# EasyEDA Pro project ProPrj_外设电路PCB板制作_2025-12-27.epro

# Schematic Schematic2
Board Name: 过压保护电路; Create Date: 2025-12-12; Page Name: P1; Project Name: 外设电路PCB板制作; Schematic Name: Schematic2; Update Date: 2025-12-12; BladeWidth: 10; Company: 嘉立创EDA; Page Size: A4; RegionStart: 1; ShowBorder: 1; TitleBlock: 1; TitleBlockPosition: 3; Version: V1.0; XRegionCount: 6; YRegionCount: 4
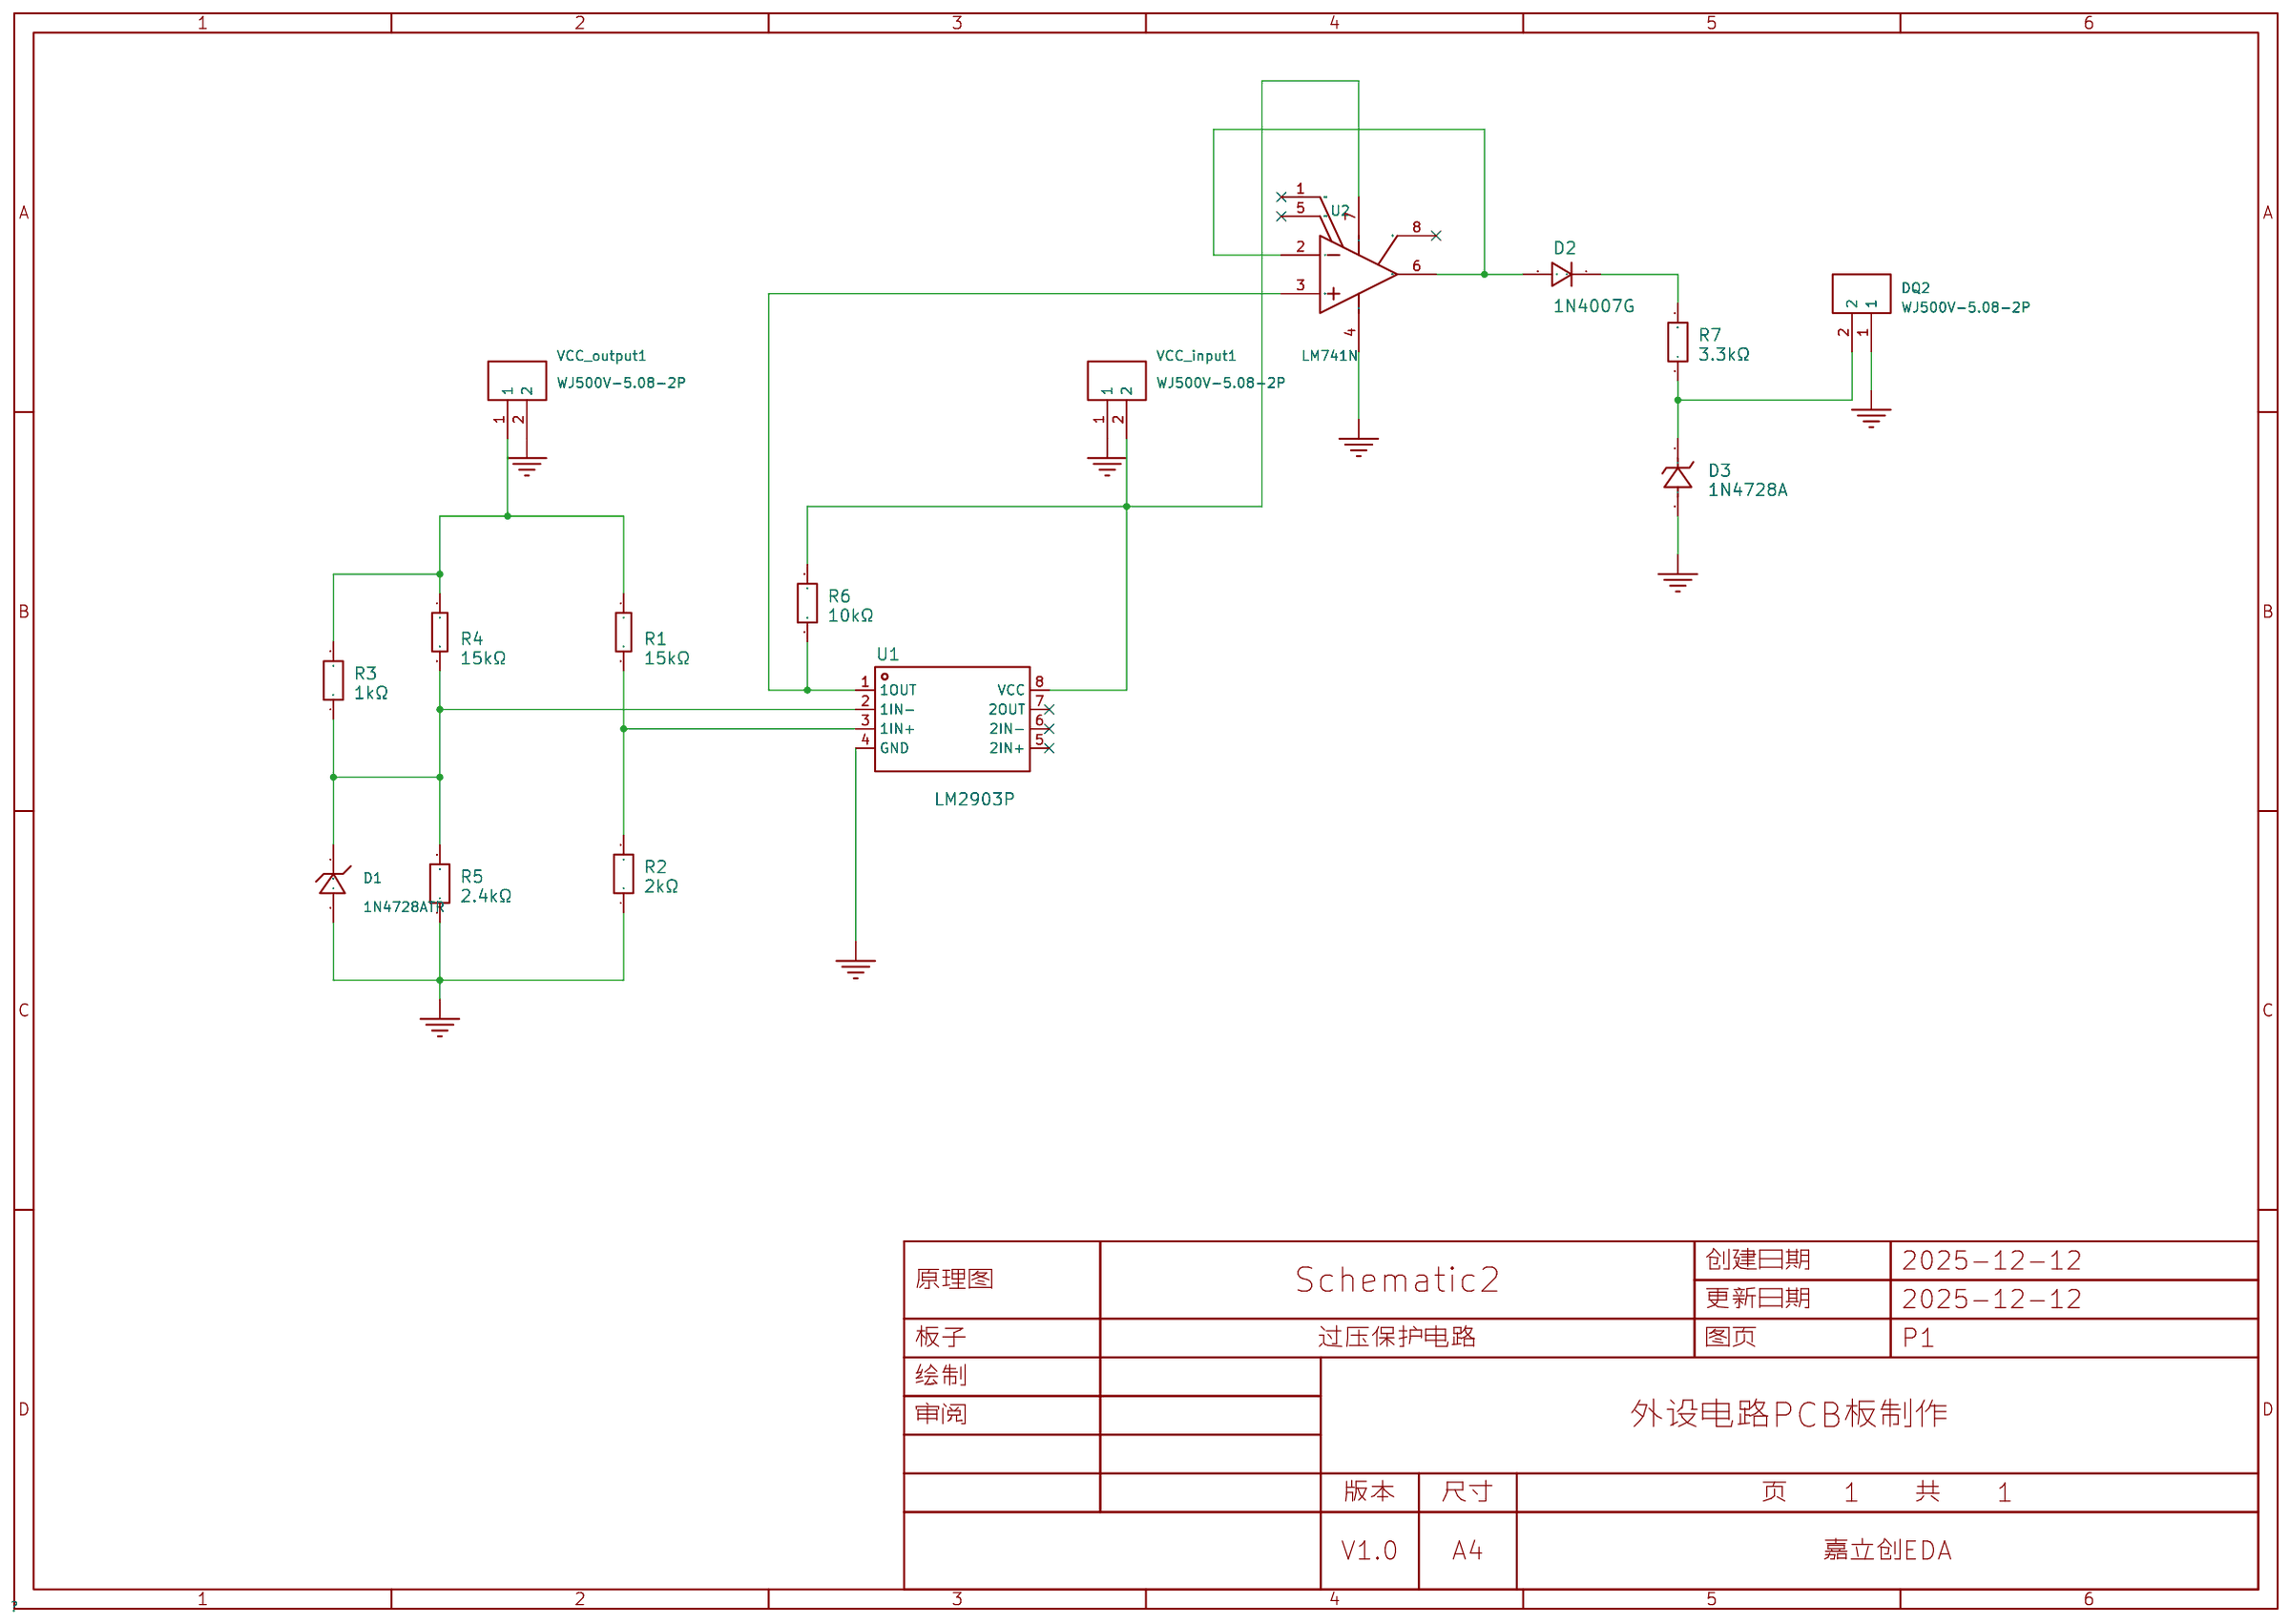
[diagram p0: schematic sheet]

## Parts
D1  1N4728ATR  [DO-41_BD2.4-L4.7-P8.70-D0.9-RD]
D2  1N4007G  [DO-41_BD2.4-L4.7-P8.70-D0.9-RD]
D3  1N4728A  [DO-41_BD2.4-L4.7-P8.70-D0.9-RD]
DQ2  WJ500V-5.08-2P  [CONN-TH_2P-P5.00_WJ500V-5.08-2P]
R1  15kΩ  [RES-TH_BD2.3-L6.5-P10.50-D0.5]
R2  2kΩ  [RES-TH_BD2.7-L6.2-P10.20-D0.4]
R3  1kΩ  [RES-TH_BD2.7-L6.2-P10.20-D0.4]
R4  2kΩ  [RES-TH_BD2.3-L6.5-P10.50-D0.5]
R5  1kΩ  [RES-TH_BD2.7-L6.2-P10.20-D0.4]
R6  1kΩ  [RES-TH_BD2.7-L6.2-P10.20-D0.4]
R7  3.3kΩ  [RES-TH_BD2.7-L6.2-P10.20-D0.4]
U1  LM2903P  [DIP-8_L9.8-W6.6-P2.54-LS7.6-BL]
U2  LM741N  [DIP-8_L9.3-W6.4-P2.54-LS7.6-BL]
VCC_input1  WJ500V-5.08-2P  [CONN-TH_2P-P5.00_WJ500V-5.08-2P]
VCC_output1  WJ500V-5.08-2P  [CONN-TH_2P-P5.00_WJ500V-5.08-2P]

## Library data of the parts
D1 = 1N4728ATR: 稳压值(标称值):3.3V;稳压值(范围):3.135V~3.465V;耗散功率(Pd):1W;; Supplier Part: C890041; Manufacturer: onsemi(安森美); Supplier Footprint: DO-41; JLCPCB Part Class: 扩展库; Datasheet: https://item.szlcsc.com/datasheet/1N4728ATR/955511.html; Supplier: LCSC; Zener Voltage(Nom): 3.3V; Reverse Leakage Current (Ir): 100uA@1V; Zener Voltage(Range): 3.135V~3.465V; Pd - Power Dissipation: 1W; Impedance(Zzt): 10Ω; Impedance(Zzk): 400Ω; Operating Junction Temperature Range: -65℃~+200℃
D2 = 1N4007G_C232439: 二极管配置:-;正向压降(Vf):930mV@1A;直流反向耐压(Vr):1kV;整流电流:1A;; Supplier Part: C232439; Manufacturer: onsemi(安森美); Supplier Footprint: DO-41; JLCPCB Part Class: 扩展库; Datasheet: https://item.szlcsc.com/datasheet/1N4007G/232362.html; Supplier: LCSC; Voltage - Forward(Vf@If): 930mV@1A; Voltage - DC Reverse(Vr): 1kV; Current - Rectified: 1A; Reverse Leakage Current (Ir): 50nA@1kV; Non-Repetitive Peak Forward Surge Current: 30A; Operating Junction Temperature Range: -65℃~+175℃
D3 = 1N4728A_C7441074: LCSC Part Name: 耐压:3.3V 电流:100uA@1V; Supplier Part: C7441074; Manufacturer: XCH(旭昌辉); Supplier Footprint: DO-41; JLCPCB Part Class: Extended Part; Datasheet: https://item.szlcsc.com/datasheet/1N4728A/8465179.html; Supplier: LCSC; Zener Voltage(Nom): 3.3V; Reverse Leakage Current (Ir): 100uA@1V; Zener Voltage(Range): 3.14V~3.47V; Pd - Power Dissipation: 1W; Impedance(Zzt): 10Ω; Impedance(Zzk): 400Ω; Operating Junction Temperature Range: -55℃~+150℃
DQ2 VCC_input1 VCC_output1 = WJ500V-5.08-2P: 结构:1x2P;间距:5.08mm;颜色:绿色;安装方式:直插;额定电流:18A;额定电压:250V;排数:1;线规 - AWG:14~30;线规 - 平方毫米:2.5;每排PIN数:2;触头材质:-;触头镀层:-;工作温度范围:-40℃~+105℃;焊接温度(最大值):-;; LCSC Part Name: 1x2P 5.08mm 直插 排数:1 每排P数:2; Supplier Part: C8465; Manufacturer: KANGNEX(康奈克斯电气); Supplier Footprint: 插件,P=5.08mm; JLCPCB Part Class: 扩展库; Datasheet: https://atta.szlcsc.com/upload/public/pdf/source/20191225/C8465_02D34CE5B5B4A53DF5891601D97FA9F4.pdf; Supplier: LCSC; Structure: 1x2P; Pitch: 5.08mm; Color: 绿色; Mounting Style: 直插; Current Rating (Max): 18A; Voltage Rating (Max): 250V; Number of Pins: 2P; Number of Rows: 1; Wire Gauge - AWG: 14~30; Wire Gauge - mm2: 2.5; Number of PINs Per Row: 2; Operating Temperature Range: -40℃~+105℃; Screw Specification: M2.5
R1 R4 = MF1/4W-2KΩ±1% T: 电阻类型:金属膜电阻;阻值:2kΩ;精度:±1%;功率:250mW;温度系数:±100ppm/℃;; LCSC Part Name: 2kΩ ±1% 250mW 金属膜电阻 圆柱状直插; Supplier Part: C119330; Manufacturer: CCO(千志电子); Supplier Footprint: 插件,D2.3xL6.5mm; JLCPCB Part Class: 扩展库; Datasheet: https://item.szlcsc.com/datasheet/MF1%252F4W-2K%25CE%25A9%25C2%25B11%2525%2520T/120599.html; Supplier: LCSC; Type: 金属膜电阻; Tolerance: ±1%; Voltage-Supply(Max): 250V; Power(Watts): 250mW; Temperature Coefficient: ±100ppm/℃; Operating Temperature: -55℃~+155℃
R2 R3 R5-R7 = MF1/4W-1K±1%-ST52: 电阻类型:金属膜电阻;阻值:1kΩ;精度:±1%;功率:250mW;温度系数:±100ppm/℃;; LCSC Part Name: 金属膜电阻 1kΩ ±1% 250mW; Supplier Part: C2903245; Manufacturer: VO(翔胜); Supplier Footprint: 插件,D2.7xL6.2mm; JLCPCB Part Class: 扩展库; Datasheet: https://item.szlcsc.com/datasheet/MF1%252F4W-1K%25C2%25B11%2525-ST52/3158996.html; Supplier: LCSC; Type: 金属膜电阻; Tolerance: ±1%; Voltage-Supply(Max): 250V; Power(Watts): 250mW; Temperature Coefficient: ±100ppm/℃; Operating Temperature: -55℃~+155℃
U1 = LM2903P: 比较器数:双路;输入失调电压(Vos):2mV;输入偏置电流(Ib):25nA;; LCSC Part Name: 双差分比较器; Supplier Part: C14770; Manufacturer: TI(德州仪器); Supplier Footprint: PDIP-8; JLCPCB Part Class: 扩展库; Datasheet: https://www.ti.com/cn/lit/gpn/lm2903; Supplier: LCSC; Number of Channels: 双路; Vos - Input Offset Voltage: 2mV; Ib - Input Bias Current: 25nA; Propagation Delay Time: 1.3us; Output Type: TTL；CMOS; Quiescent Current: 800uA; Operating Temperature: -40℃~+125℃
U2 = LM741N: 放大器数:单路;轨到轨:-;增益带宽积(GBP):1.5MHz;输入失调电压(Vos):5mV;压摆率(SR):500V/ms;输入偏置电流(Ib):500nA;; LCSC Part Name: LM741通用运算放大器; Supplier Part: C22446595; Manufacturer: HGSEMI(华冠); Supplier Footprint: DIP-8; JLCPCB Part Class: 扩展库; Datasheet: https://item.szlcsc.com/datasheet/LM741N/24099143.html; Supplier: LCSC; Number of Channels: 单路; Maximum Power Supply Range (Vdd-Vss): 36V; Gain Bandwidth Product: 1.5MHz; Vos - Input Offset Voltage: 5mV; Input Offset Voltage Drift(Vos TC): 15uV/℃; Slew Rate: 500V/ms; Ib - Input Bias Current: 500nA; Input Offset Current(Ios): 200nA; Common Mode Rejection Ratio(CMRR): 90dB; Quiescent Current: 1.7mA; Output Current: 25mA; Operating Temperature: 0℃~+70℃; Dual Supply: -15V~15V

## Nets
GND: D1.2(A) D3.2(A) DQ2.1 R2.1 R5.1 U1.4(GND) U2.4(V-) VCC_input1.1 VCC_output1.2
$1N377: D1.1(C) R3.1 R4.2 R5.2 U1.2(1IN-)
$1N380: R1.2 R2.2 U1.3(1IN+)
$1N382: R1.1 R3.2 R4.1 VCC_output1.1
$1N684: R6.2 U1.8(VCC) U2.7(V+) VCC_input1.2
$1N799: R6.1 U1.1(1OUT) U2.3(+IN)
$1N820: D3.1(K) DQ2.2 R7.1
$1N822: D2.1 R7.2
$1N824: D2.2 U2.2(-IN) U2.6(OUT)

Not connected (* = marked no-connect by the designer): U1 5(2IN+)* 6(2IN-)* 7(2OUT)*; U2 1(OFFSET NULL)* 5(OFFSET NULL)* 8(NC)*

# Schematic Schematic1
Board Name: 过流保护电路; Create Date: 2025-12-11; Page Name: P1; Project Name: 外设电路PCB板制作; Schematic Name: Schematic1; Update Date: 2025-12-11; BladeWidth: 10; Company: 嘉立创EDA; Page Size: A4; RegionStart: 1; ShowBorder: 1; TitleBlock: 1; TitleBlockPosition: 3; Version: V1.0; XRegionCount: 6; YRegionCount: 4
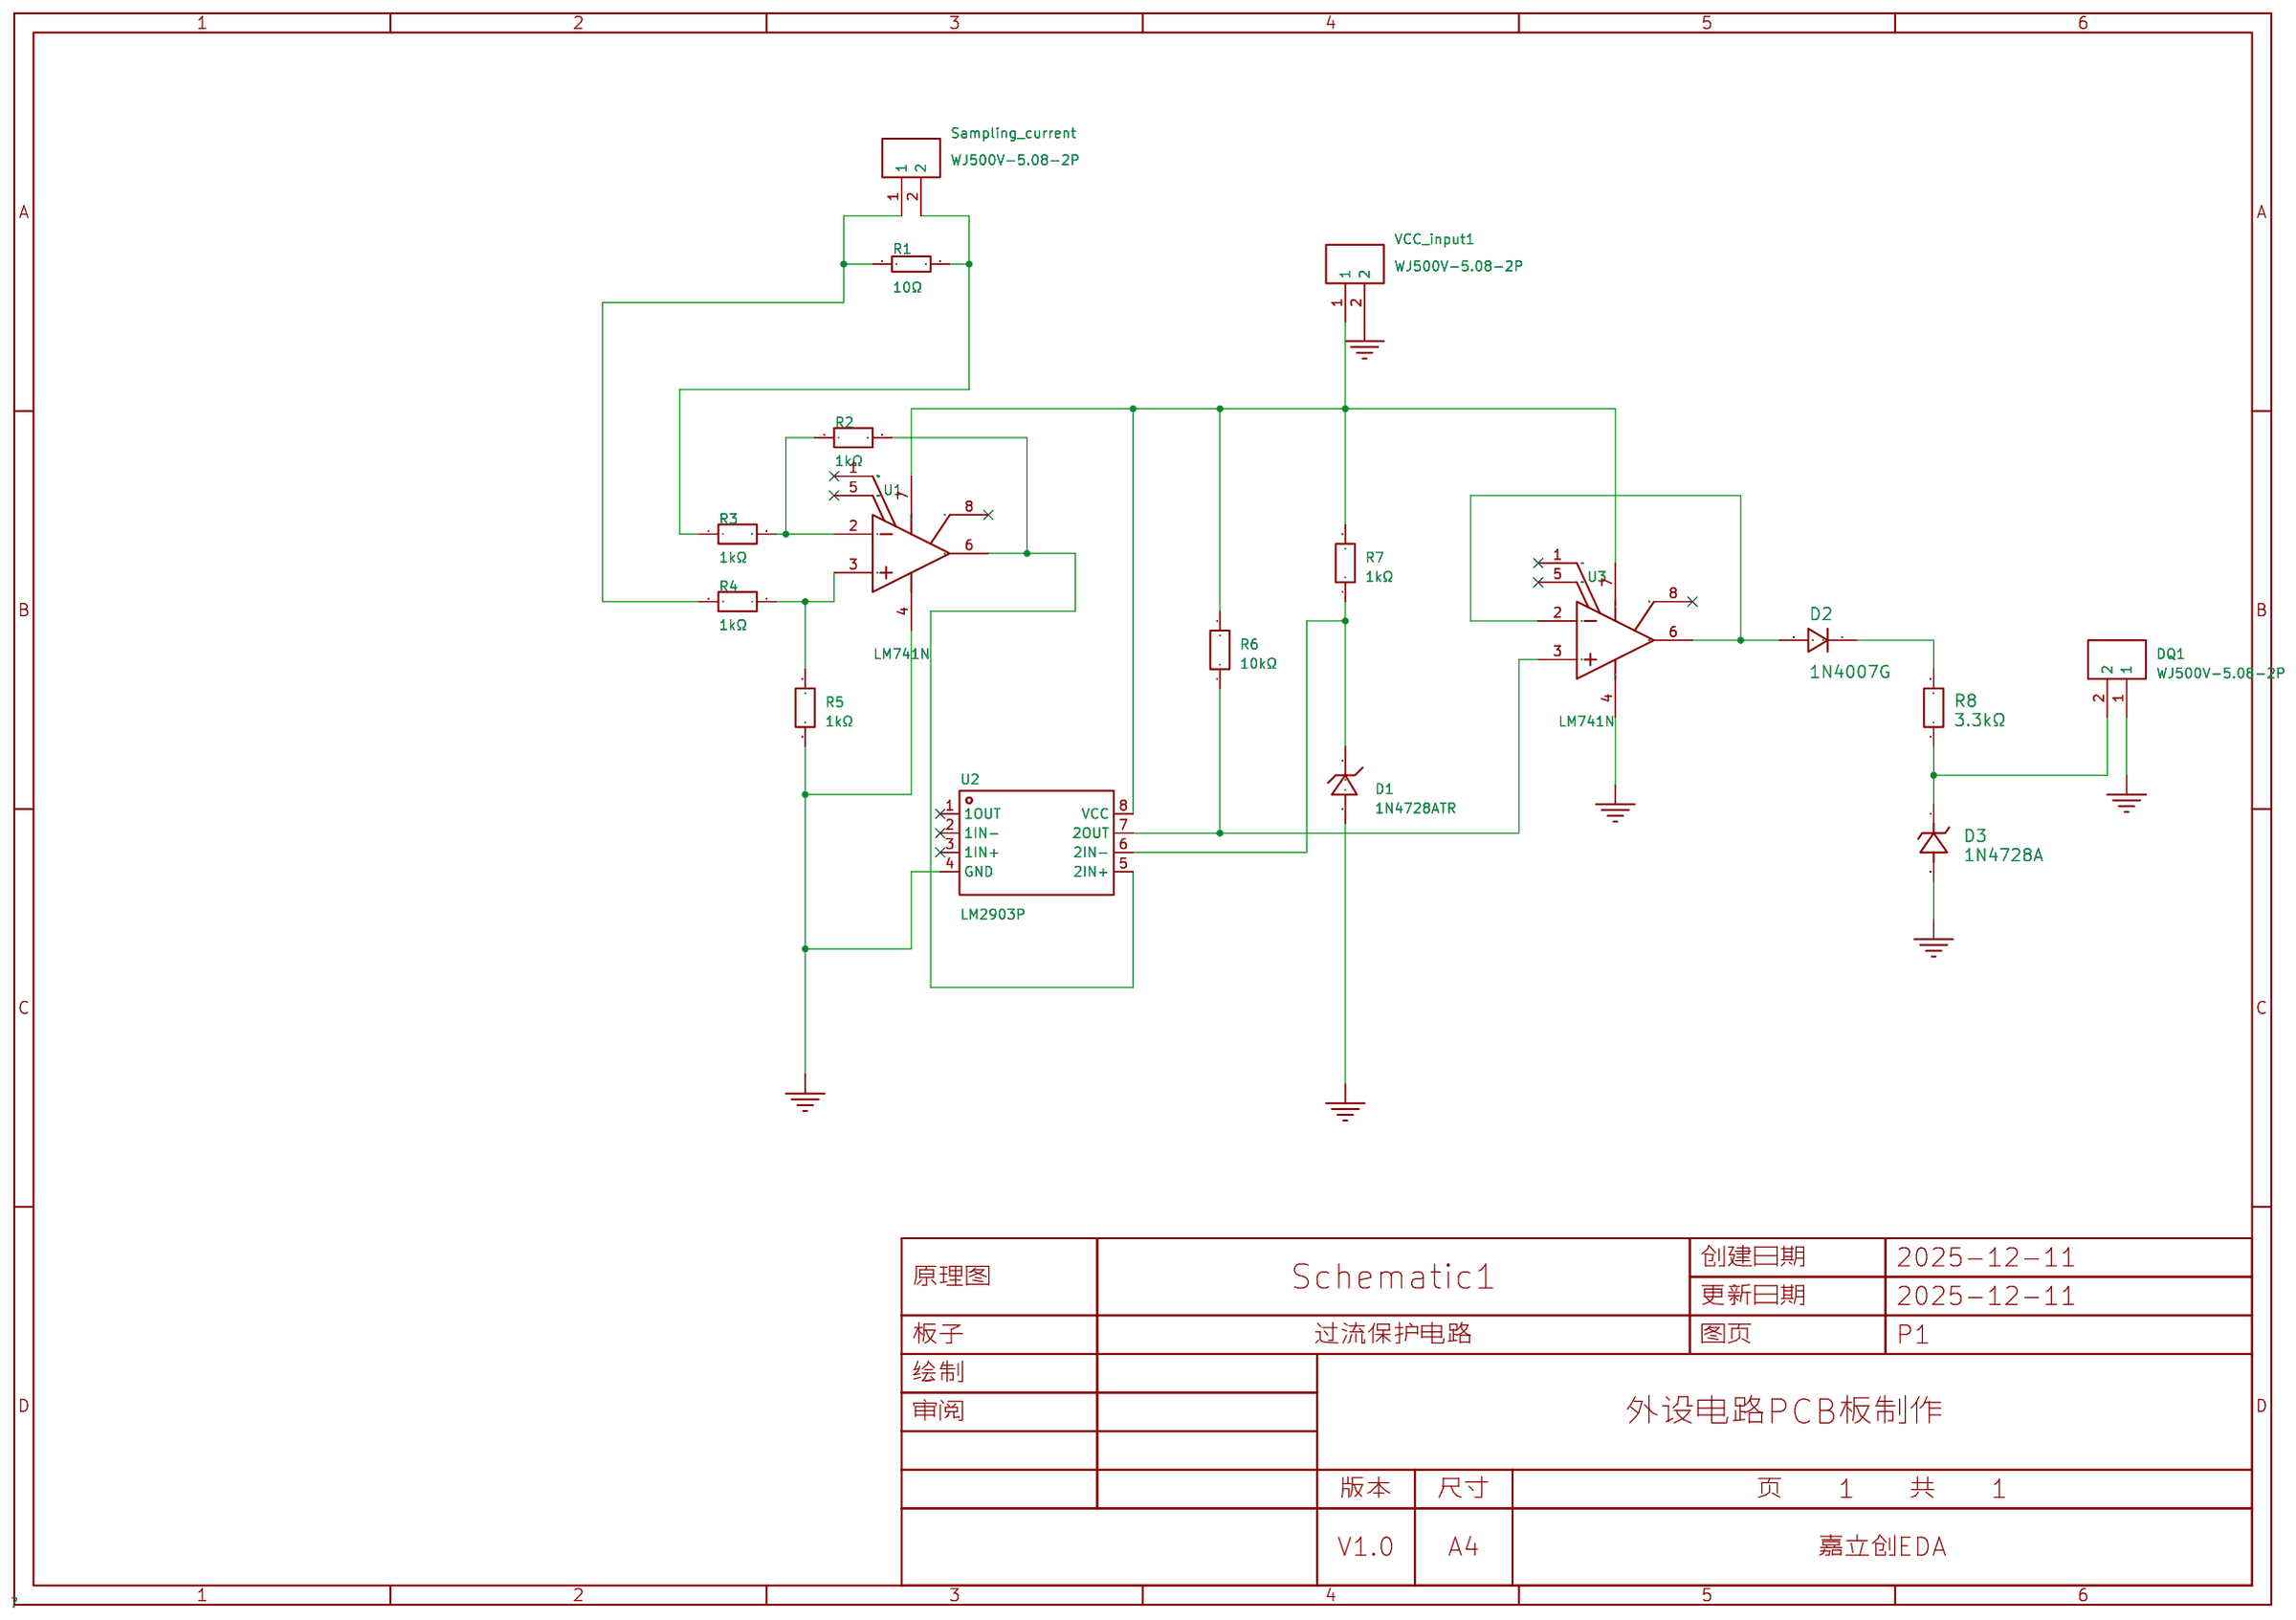
[diagram p1: schematic sheet]

## Parts
D1  1N4728ATR  [DO-41_BD2.4-L4.7-P8.70-D0.9-RD]
D2  1N4007G  [DO-41_BD2.4-L4.7-P8.70-D0.9-RD]
D3  1N4728A  [DO-41_BD2.4-L4.7-P8.70-D0.9-RD]
DQ1  WJ500V-5.08-2P  [CONN-TH_2P-P5.00_WJ500V-5.08-2P]
R1  10Ω  [RES-TH_BD9.0-L36.5-P40.50-D0.8]
R2  1kΩ  [RES-TH_BD2.7-L6.2-P10.20-D0.4]
R3  1kΩ  [RES-TH_BD2.7-L6.2-P10.20-D0.4]
R4  1kΩ  [RES-TH_BD2.7-L6.2-P10.20-D0.4]
R5  1kΩ  [RES-TH_BD2.7-L6.2-P10.20-D0.4]
R6  1kΩ  [RES-TH_BD2.7-L6.2-P10.20-D0.4]
R7  1kΩ  [RES-TH_BD2.7-L6.2-P10.20-D0.4]
R8  1kΩ  [RES-TH_BD2.7-L6.2-P10.20-D0.4]
Sampling_current  WJ500V-5.08-2P  [CONN-TH_2P-P5.00_WJ500V-5.08-2P]
U1  LM741N  [DIP-8_L9.3-W6.4-P2.54-LS7.6-BL]
U2  LM2903P  [DIP-8_L9.8-W6.6-P2.54-LS7.6-BL]
U3  LM741N  [DIP-8_L9.3-W6.4-P2.54-LS7.6-BL]
VCC_input1  WJ500V-5.08-2P  [CONN-TH_2P-P5.00_WJ500V-5.08-2P]

## Library data of the parts
D1 = 1N4728ATR: 稳压值(标称值):3.3V;稳压值(范围):3.135V~3.465V;耗散功率(Pd):1W;; Supplier Part: C890041; Manufacturer: onsemi(安森美); Supplier Footprint: DO-41; JLCPCB Part Class: 扩展库; Datasheet: https://item.szlcsc.com/datasheet/1N4728ATR/955511.html; Supplier: LCSC; Zener Voltage(Nom): 3.3V; Reverse Leakage Current (Ir): 100uA@1V; Zener Voltage(Range): 3.135V~3.465V; Pd - Power Dissipation: 1W; Impedance(Zzt): 10Ω; Impedance(Zzk): 400Ω; Operating Junction Temperature Range: -65℃~+200℃
D2 = 1N4007G_C232439: 二极管配置:-;正向压降(Vf):930mV@1A;直流反向耐压(Vr):1kV;整流电流:1A;; Supplier Part: C232439; Manufacturer: onsemi(安森美); Supplier Footprint: DO-41; JLCPCB Part Class: 扩展库; Datasheet: https://item.szlcsc.com/datasheet/1N4007G/232362.html; Supplier: LCSC; Voltage - Forward(Vf@If): 930mV@1A; Voltage - DC Reverse(Vr): 1kV; Current - Rectified: 1A; Reverse Leakage Current (Ir): 50nA@1kV; Non-Repetitive Peak Forward Surge Current: 30A; Operating Junction Temperature Range: -65℃~+175℃
D3 = 1N4728A_C7441074: LCSC Part Name: 耐压:3.3V 电流:100uA@1V; Supplier Part: C7441074; Manufacturer: XCH(旭昌辉); Supplier Footprint: DO-41; JLCPCB Part Class: Extended Part; Datasheet: https://item.szlcsc.com/datasheet/1N4728A/8465179.html; Supplier: LCSC; Zener Voltage(Nom): 3.3V; Reverse Leakage Current (Ir): 100uA@1V; Zener Voltage(Range): 3.14V~3.47V; Pd - Power Dissipation: 1W; Impedance(Zzt): 10Ω; Impedance(Zzk): 400Ω; Operating Junction Temperature Range: -55℃~+150℃
DQ1 Sampling_current VCC_input1 = WJ500V-5.08-2P: 结构:1x2P;间距:5.08mm;颜色:绿色;安装方式:直插;额定电流:18A;额定电压:250V;排数:1;线规 - AWG:14~30;线规 - 平方毫米:2.5;每排PIN数:2;触头材质:-;触头镀层:-;工作温度范围:-40℃~+105℃;焊接温度(最大值):-;; LCSC Part Name: 1x2P 5.08mm 直插 排数:1 每排P数:2; Supplier Part: C8465; Manufacturer: KANGNEX(康奈克斯电气); Supplier Footprint: 插件,P=5.08mm; JLCPCB Part Class: 扩展库; Datasheet: https://atta.szlcsc.com/upload/public/pdf/source/20191225/C8465_02D34CE5B5B4A53DF5891601D97FA9F4.pdf; Supplier: LCSC; Structure: 1x2P; Pitch: 5.08mm; Color: 绿色; Mounting Style: 直插; Current Rating (Max): 18A; Voltage Rating (Max): 250V; Number of Pins: 2P; Number of Rows: 1; Wire Gauge - AWG: 14~30; Wire Gauge - mm2: 2.5; Number of PINs Per Row: 2; Operating Temperature Range: -40℃~+105℃; Screw Specification: M2.5
R1 = EWWR0010J10R0T9: 电阻类型:绕线电阻;阻值:10Ω;精度:±5%;功率:10W;温度系数:±250ppm/℃;; LCSC Part Name: 绕线电阻 10Ω ±5% 10W; Supplier Part: C349084; Manufacturer: RESI(开步睿思); Supplier Footprint: 插件,D9xL36.5mm; JLCPCB Part Class: 扩展库; Datasheet: https://item.szlcsc.com/datasheet/EWWR0010J10R0T9/325541.html; Supplier: LCSC; Type: 绕线电阻; Tolerance: ±5%; Power(Watts): 10W; Temperature Coefficient: ±250ppm/℃; Operating Temperature: -55℃~+155℃
R2-R8 = MF1/4W-1K±1%-ST52: 电阻类型:金属膜电阻;阻值:1kΩ;精度:±1%;功率:250mW;温度系数:±100ppm/℃;; LCSC Part Name: 金属膜电阻 1kΩ ±1% 250mW; Supplier Part: C2903245; Manufacturer: VO(翔胜); Supplier Footprint: 插件,D2.7xL6.2mm; JLCPCB Part Class: 扩展库; Datasheet: https://item.szlcsc.com/datasheet/MF1%252F4W-1K%25C2%25B11%2525-ST52/3158996.html; Supplier: LCSC; Type: 金属膜电阻; Tolerance: ±1%; Voltage-Supply(Max): 250V; Power(Watts): 250mW; Temperature Coefficient: ±100ppm/℃; Operating Temperature: -55℃~+155℃
U1 U3 = LM741N: 放大器数:单路;轨到轨:-;增益带宽积(GBP):1.5MHz;输入失调电压(Vos):5mV;压摆率(SR):500V/ms;输入偏置电流(Ib):500nA;; LCSC Part Name: LM741通用运算放大器; Supplier Part: C22446595; Manufacturer: HGSEMI(华冠); Supplier Footprint: DIP-8; JLCPCB Part Class: 扩展库; Datasheet: https://item.szlcsc.com/datasheet/LM741N/24099143.html; Supplier: LCSC; Number of Channels: 单路; Maximum Power Supply Range (Vdd-Vss): 36V; Gain Bandwidth Product: 1.5MHz; Vos - Input Offset Voltage: 5mV; Input Offset Voltage Drift(Vos TC): 15uV/℃; Slew Rate: 500V/ms; Ib - Input Bias Current: 500nA; Input Offset Current(Ios): 200nA; Common Mode Rejection Ratio(CMRR): 90dB; Quiescent Current: 1.7mA; Output Current: 25mA; Operating Temperature: 0℃~+70℃; Dual Supply: -15V~15V
U2 = LM2903P: 比较器数:双路;输入失调电压(Vos):2mV;输入偏置电流(Ib):25nA;; LCSC Part Name: 双差分比较器; Supplier Part: C14770; Manufacturer: TI(德州仪器); Supplier Footprint: PDIP-8; JLCPCB Part Class: 扩展库; Datasheet: https://www.ti.com/cn/lit/gpn/lm2903; Supplier: LCSC; Number of Channels: 双路; Vos - Input Offset Voltage: 2mV; Ib - Input Bias Current: 25nA; Propagation Delay Time: 1.3us; Output Type: TTL；CMOS; Quiescent Current: 800uA; Operating Temperature: -40℃~+125℃

## Nets
GND: D1.2(A) D3.2(A) DQ1.1 R5.2 U1.4(V-) U2.4(GND) U3.4(V-) VCC_input1.2
$1N608: R1.2 R3.1 Sampling_current.2
$1N609: R1.1 R4.2 Sampling_current.1
$1N610: R2.1 R3.2 U1.2(-IN)
$1N611: R2.2 U1.6(OUT) U2.5(2IN+)
$1N612: R4.1 R5.1 U1.3(+IN)
$1N614: D1.1(C) R7.1 U2.6(2IN-)
$1N617: R6.1 U2.7(2OUT) U3.3(+IN)
$1N1128: R6.2 R7.2 U1.7(V+) U2.8(VCC) U3.7(V+) VCC_input1.1
$1N1185: D2.1 R8.2
$1N1187: D3.1(K) DQ1.2 R8.1
$1N1190: D2.2 U3.2(-IN) U3.6(OUT)

Not connected (* = marked no-connect by the designer): U1 1(OFFSET NULL)* 5(OFFSET NULL)* 8(NC)*; U2 1(1OUT)* 2(1IN-)* 3(1IN+)*; U3 1(OFFSET NULL)* 5(OFFSET NULL)* 8(NC)*

# Schematic Schematic3
Assembly Variant: Basic; Board Name: Board1; Create Date: 2025-12-14; Page Name: P1; Project Name: 外设电路PCB板制作; Schematic Name: Schematic3; Update Date: 2025-12-14; BladeWidth: 10; Company: 嘉立创EDA; Page Size: A4; RegionStart: 1; ShowBorder: 1; TitleBlock: 1; TitleBlockPosition: 3; Version: V1.0; XRegionCount: 6; YRegionCount: 4
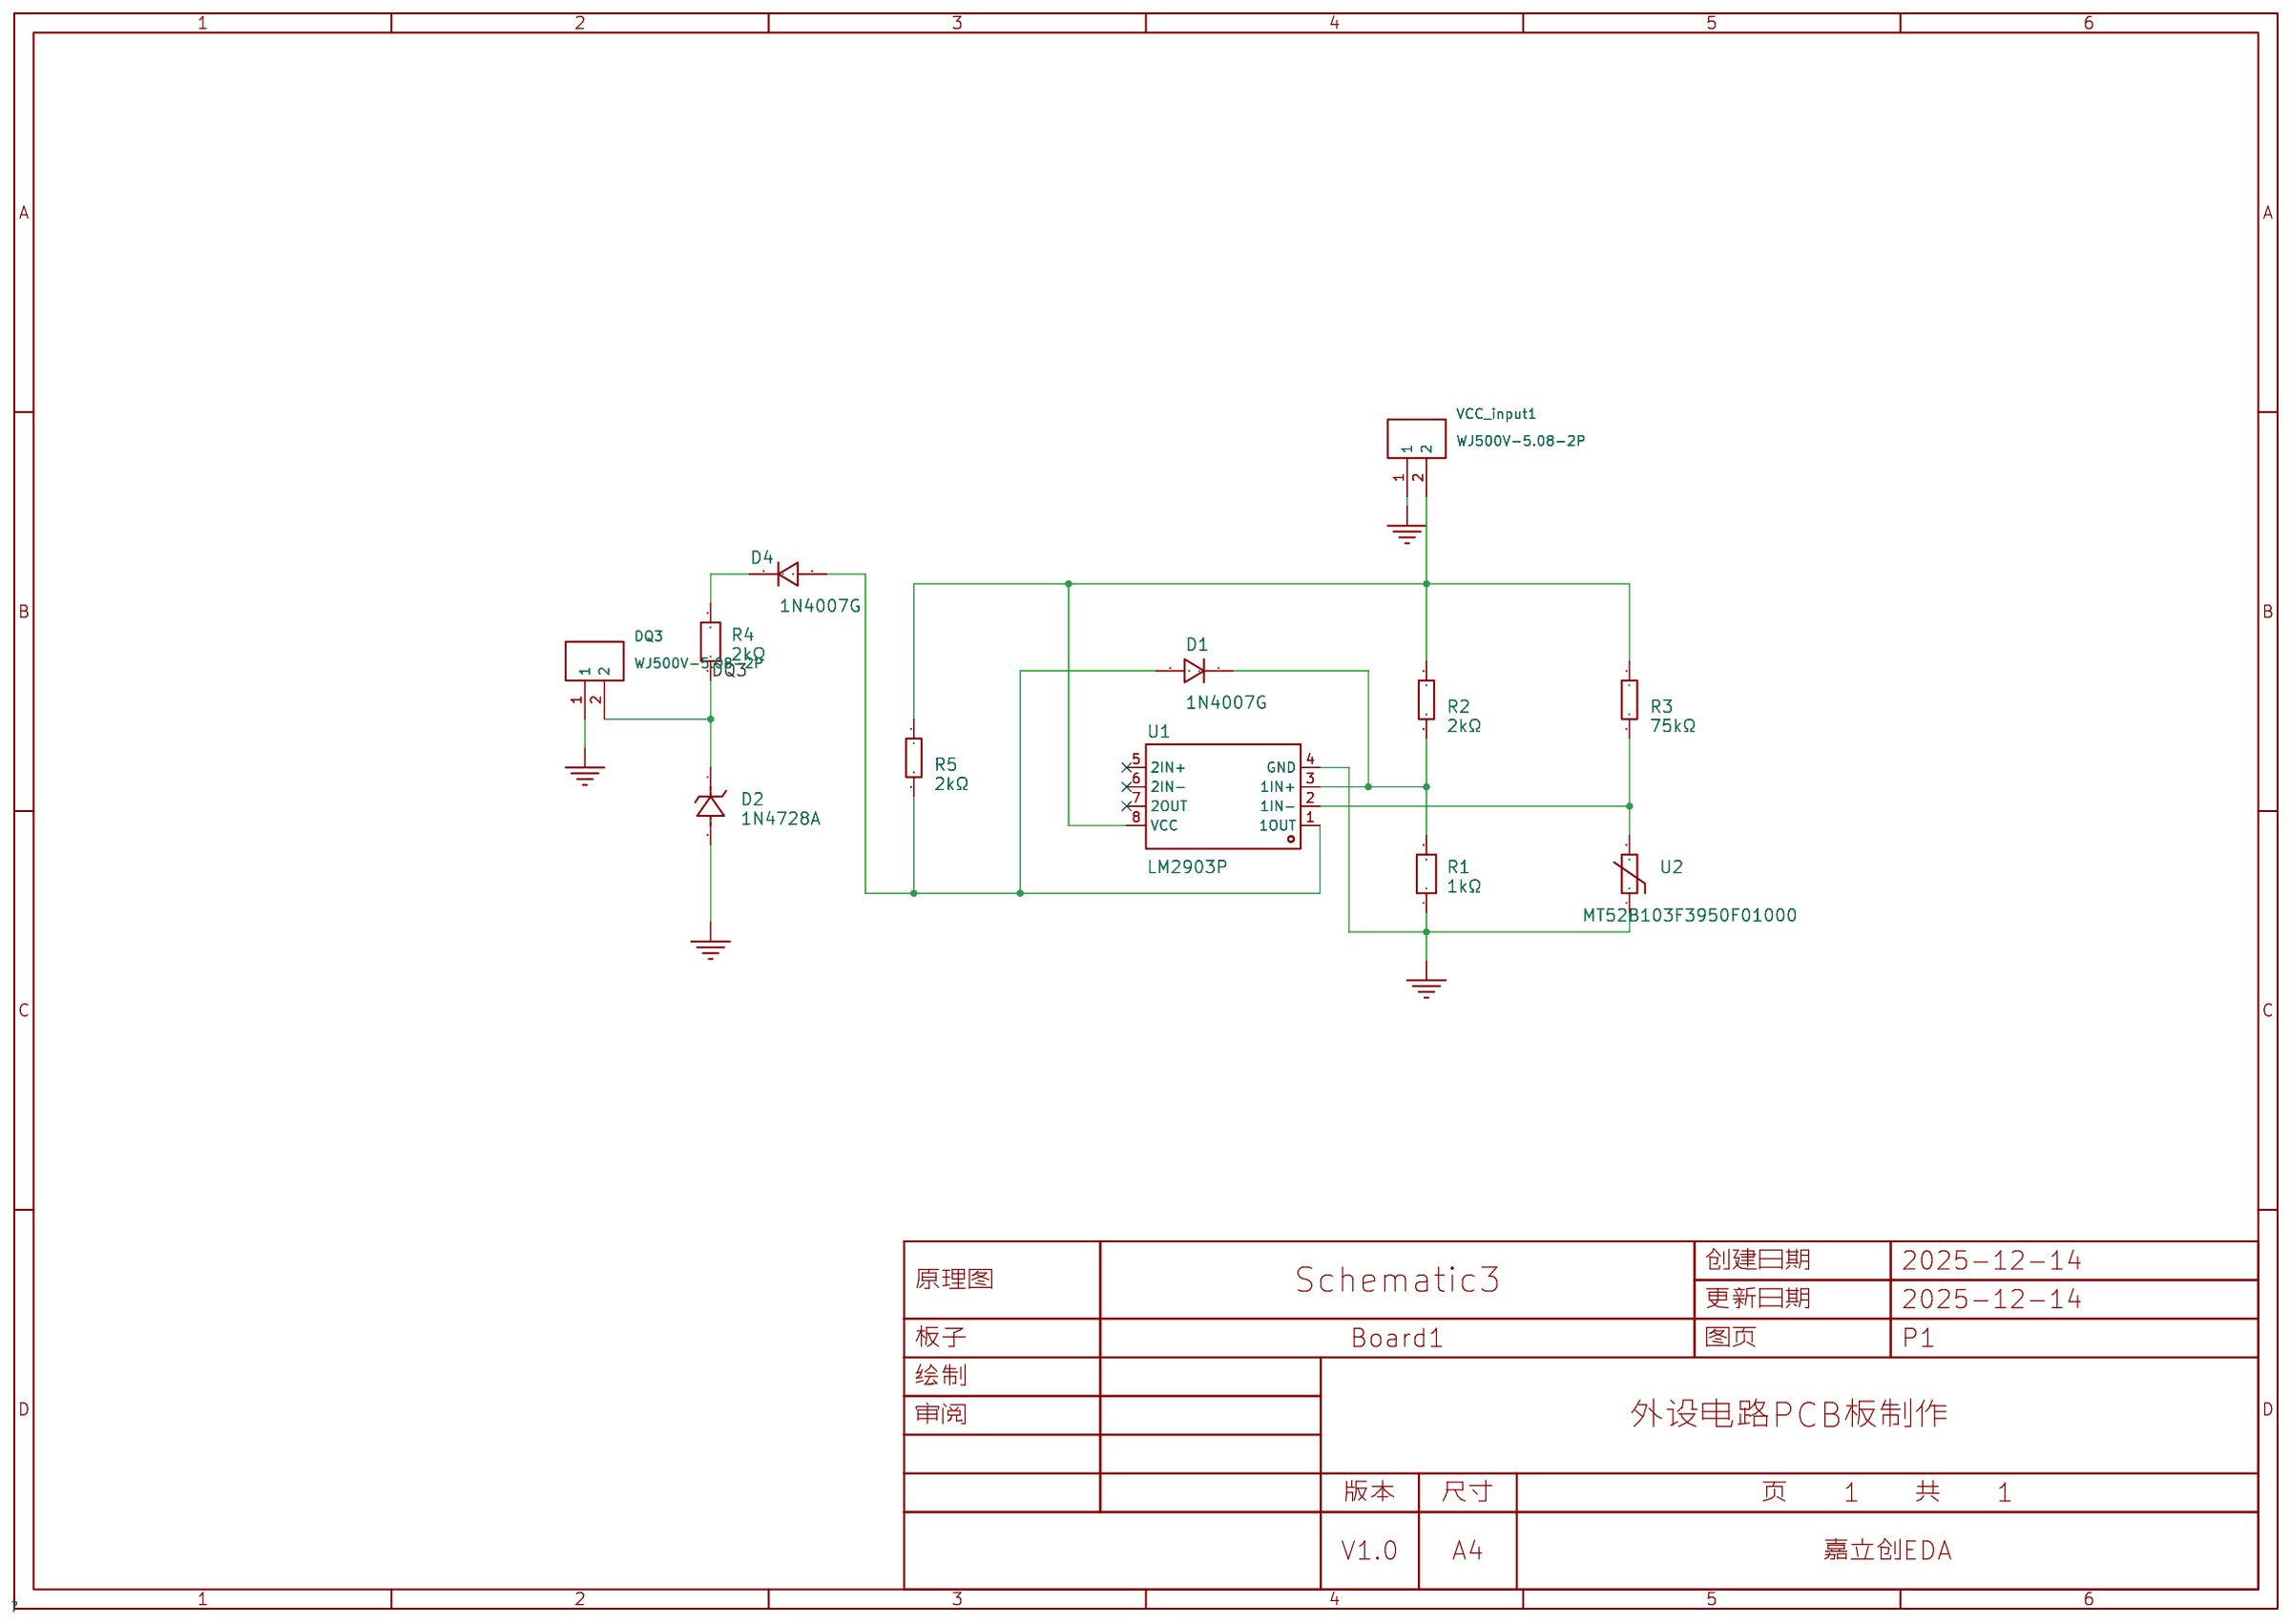
[diagram p2: schematic sheet]

## Parts
D1  1N4007G  [DO-41_BD2.4-L4.7-P8.70-D0.9-RD]
D2  1N4728A  [DO-41_BD2.4-L4.7-P8.70-D0.9-RD]
D4  1N4007G  [DO-41_BD2.4-L4.7-P8.70-D0.9-RD]
DQ3  WJ500V-5.08-2P  [CONN-TH_2P-P5.00_WJ500V-5.08-2P]
R1  1kΩ  [RES-TH_BD2.7-L6.2-P10.20-D0.4]
R2  2kΩ  [RES-TH_BD2.3-L6.5-P10.50-D0.5]
R3  75kΩ  [RES-TH_BD2.3-L6.5-P10.50-D0.5]
R4  1kΩ  [RES-TH_BD2.7-L6.2-P10.20-D0.4]
R5  2kΩ  [RES-TH_BD2.3-L6.5-P10.50-D0.5]
U1  LM2903P  [DIP-8_L9.8-W6.6-P2.54-LS7.6-BL]
U2  MT52B103F3950F01000  [RES-TH_BD2.0-P1.80-D0.3]
VCC_input1  WJ500V-5.08-2P  [CONN-TH_2P-P5.00_WJ500V-5.08-2P]

## Library data of the parts
D1 D4 = 1N4007G_C232439: 二极管配置:-;正向压降(Vf):930mV@1A;直流反向耐压(Vr):1kV;整流电流:1A;; Supplier Part: C232439; Manufacturer: onsemi(安森美); Supplier Footprint: DO-41; JLCPCB Part Class: 扩展库; Datasheet: https://item.szlcsc.com/datasheet/1N4007G/232362.html; Supplier: LCSC; Voltage - Forward(Vf@If): 930mV@1A; Voltage - DC Reverse(Vr): 1kV; Current - Rectified: 1A; Reverse Leakage Current (Ir): 50nA@1kV; Non-Repetitive Peak Forward Surge Current: 30A; Operating Junction Temperature Range: -65℃~+175℃
D2 = 1N4728A_C7441074: LCSC Part Name: 耐压:3.3V 电流:100uA@1V; Supplier Part: C7441074; Manufacturer: XCH(旭昌辉); Supplier Footprint: DO-41; JLCPCB Part Class: Extended Part; Datasheet: https://item.szlcsc.com/datasheet/1N4728A/8465179.html; Supplier: LCSC; Zener Voltage(Nom): 3.3V; Reverse Leakage Current (Ir): 100uA@1V; Zener Voltage(Range): 3.14V~3.47V; Pd - Power Dissipation: 1W; Impedance(Zzt): 10Ω; Impedance(Zzk): 400Ω; Operating Junction Temperature Range: -55℃~+150℃
DQ3 VCC_input1 = WJ500V-5.08-2P: 结构:1x2P;间距:5.08mm;颜色:绿色;安装方式:直插;额定电流:18A;额定电压:250V;排数:1;线规 - AWG:14~30;线规 - 平方毫米:2.5;每排PIN数:2;触头材质:-;触头镀层:-;工作温度范围:-40℃~+105℃;焊接温度(最大值):-;; LCSC Part Name: 1x2P 5.08mm 直插 排数:1 每排P数:2; Supplier Part: C8465; Manufacturer: KANGNEX(康奈克斯电气); Supplier Footprint: 插件,P=5.08mm; JLCPCB Part Class: 扩展库; Datasheet: https://atta.szlcsc.com/upload/public/pdf/source/20191225/C8465_02D34CE5B5B4A53DF5891601D97FA9F4.pdf; Supplier: LCSC; Structure: 1x2P; Pitch: 5.08mm; Color: 绿色; Mounting Style: 直插; Current Rating (Max): 18A; Voltage Rating (Max): 250V; Number of Pins: 2P; Number of Rows: 1; Wire Gauge - AWG: 14~30; Wire Gauge - mm2: 2.5; Number of PINs Per Row: 2; Operating Temperature Range: -40℃~+105℃; Screw Specification: M2.5
R1 R4 = MF1/4W-1K±1%-ST52: 电阻类型:金属膜电阻;阻值:1kΩ;精度:±1%;功率:250mW;温度系数:±100ppm/℃;; LCSC Part Name: 金属膜电阻 1kΩ ±1% 250mW; Supplier Part: C2903245; Manufacturer: VO(翔胜); Supplier Footprint: 插件,D2.7xL6.2mm; JLCPCB Part Class: 扩展库; Datasheet: https://item.szlcsc.com/datasheet/MF1%252F4W-1K%25C2%25B11%2525-ST52/3158996.html; Supplier: LCSC; Type: 金属膜电阻; Tolerance: ±1%; Voltage-Supply(Max): 250V; Power(Watts): 250mW; Temperature Coefficient: ±100ppm/℃; Operating Temperature: -55℃~+155℃
R2 R3 R5 = MF1/4W-2KΩ±1% T: 电阻类型:金属膜电阻;阻值:2kΩ;精度:±1%;功率:250mW;温度系数:±100ppm/℃;; LCSC Part Name: 2kΩ ±1% 250mW 金属膜电阻 圆柱状直插; Supplier Part: C119330; Manufacturer: CCO(千志电子); Supplier Footprint: 插件,D2.3xL6.5mm; JLCPCB Part Class: 扩展库; Datasheet: https://item.szlcsc.com/datasheet/MF1%252F4W-2K%25CE%25A9%25C2%25B11%2525%2520T/120599.html; Supplier: LCSC; Type: 金属膜电阻; Tolerance: ±1%; Voltage-Supply(Max): 250V; Power(Watts): 250mW; Temperature Coefficient: ±100ppm/℃; Operating Temperature: -55℃~+155℃
U1 = LM2903P: 比较器数:双路;输入失调电压(Vos):2mV;输入偏置电流(Ib):25nA;; LCSC Part Name: 双差分比较器; Supplier Part: C14770; Manufacturer: TI(德州仪器); Supplier Footprint: PDIP-8; JLCPCB Part Class: 扩展库; Datasheet: https://www.ti.com/cn/lit/gpn/lm2903; Supplier: LCSC; Number of Channels: 双路; Vos - Input Offset Voltage: 2mV; Ib - Input Bias Current: 25nA; Propagation Delay Time: 1.3us; Output Type: TTL；CMOS; Quiescent Current: 800uA; Operating Temperature: -40℃~+125℃
U2 = MT52B103F3950F01000: B值精度:±1%;; Supplier Part: C3000141; Manufacturer: STE(松田); Supplier Footprint: 插件; JLCPCB Part Class: 扩展库; Datasheet: https://atta.szlcsc.com/upload/public/pdf/source/20220421/4C9ED61AEEBD0560001C4E62DFAA304B.pdf; Supplier: LCSC; B Constant Tolerance: ±1%

## Nets
GND: D2.2(A) DQ3.1 R1.1 U1.4(GND) U2.1 VCC_input1.1
DQ3: D2.1(K) DQ3.2 R4.1
$1N1: D1.1 R1.2 R2.2 U1.3(1IN+)
$1N2: R3.2 U1.2(1IN-) U2.2
$1N3: D1.2 D4.2 R5.2 U1.1(1OUT)
$1N5: R2.1 R3.1 R5.1 U1.8(VCC) VCC_input1.2
$1N12: D4.1 R4.2

Not connected (* = marked no-connect by the designer): U1 5(2IN+)* 6(2IN-)* 7(2OUT)*

# Board PCB1
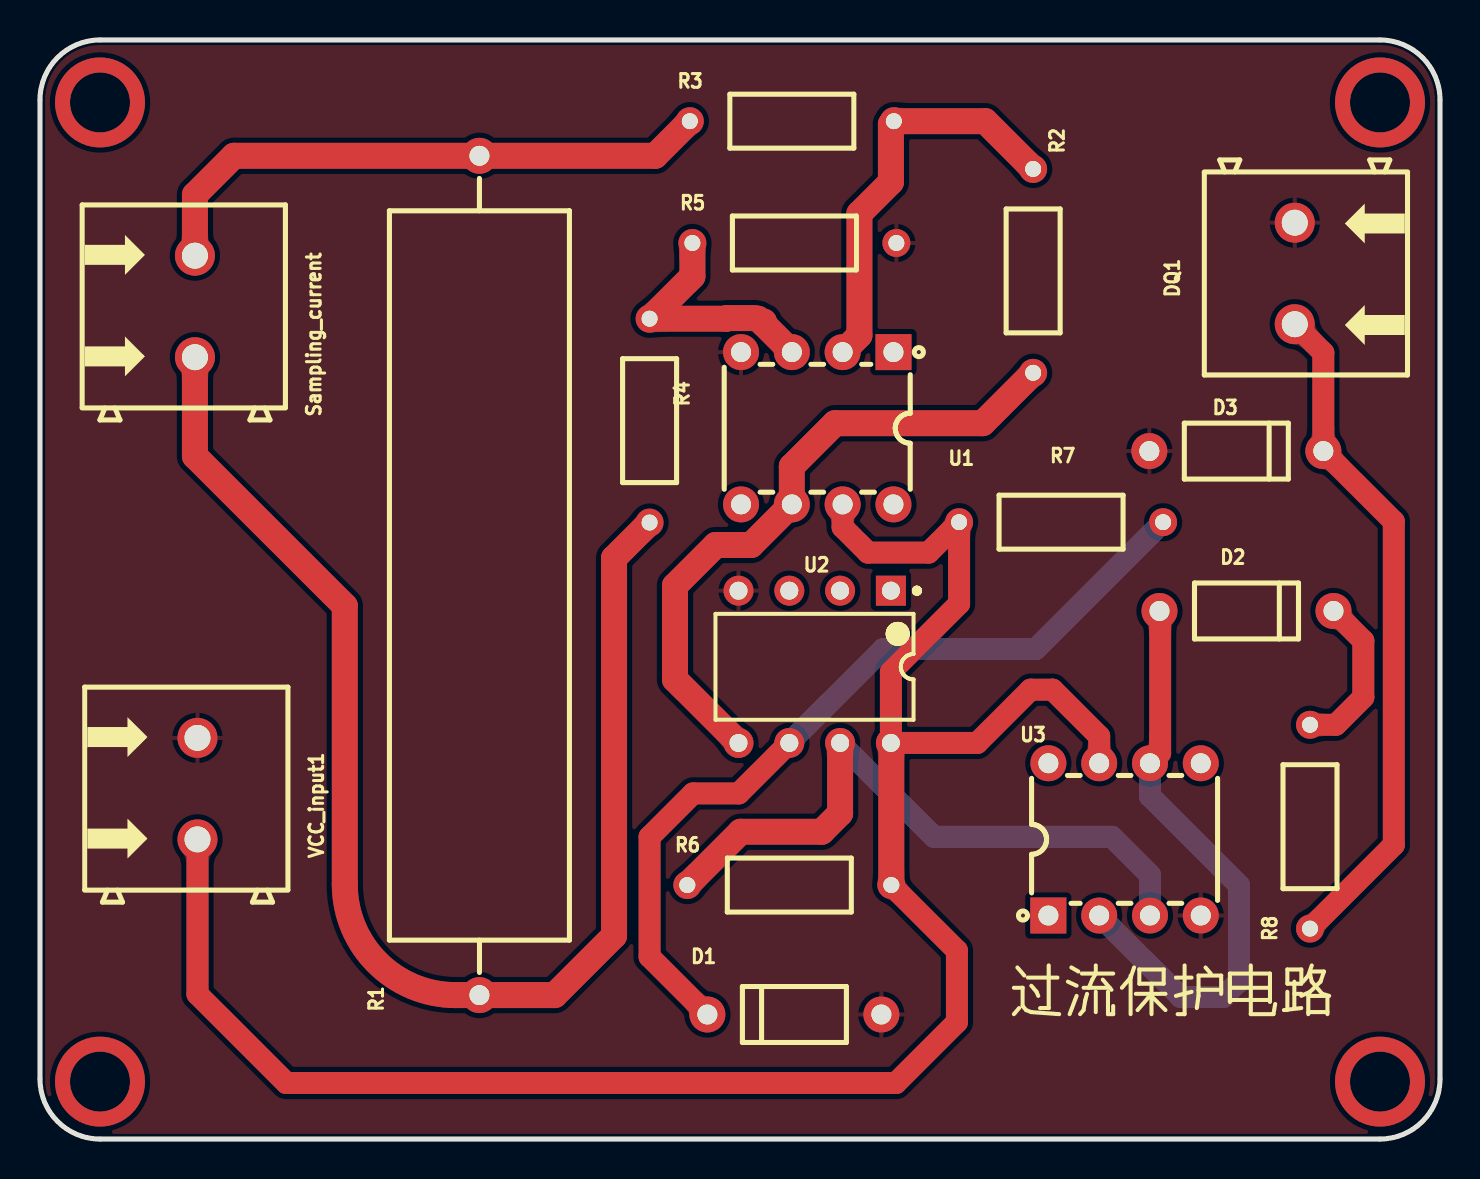
[diagram p3: board, top side]
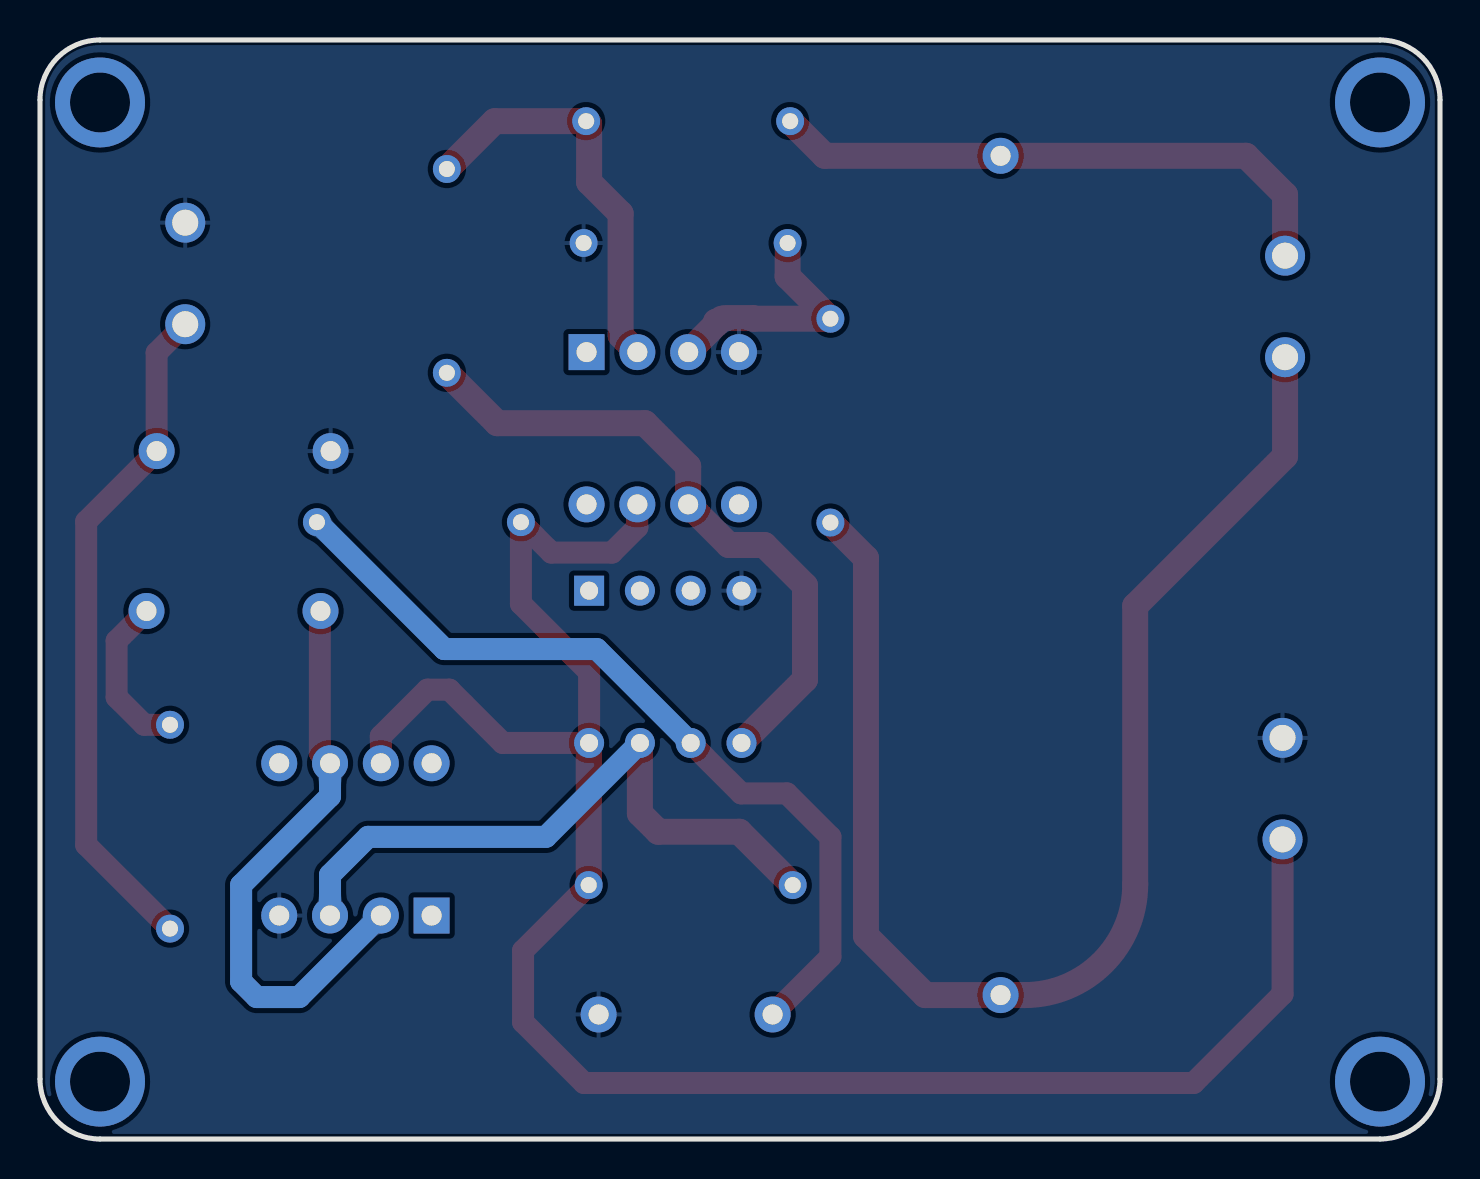
[diagram p4: board, bottom side, seen from below]

Outline 70 x 55 mm; copper layers: Top Layer, Bottom Layer. Coordinates in mm from the lower left corner of the outline.
Outline path: 0,52 0,3 arc(0.88,0.88) 3,0 67,0 arc(69.12,0.88) 70,3 70,52 arc(69.12,54.12) 67,55 3,55 arc(0.88,54.12) 0,52
Stack: Top Layer 0.035mm / Dielectric1 1.51mm FR4 er 4.5 / Bottom Layer 0.035mm

## Design rules (mm)
spacing copperThickness1oz (default): track to track 0.102, other pairs 0.152 to 0.3
spacing copperThickness2oz: track to track 0.203, other pairs 0.152 to 0.3
spacing Plane_innerPlane: track to track 0.102, other pairs 0.152 to 0.3
spacing Copper_copperRegion: track to track 0.102, other pairs 0.152 to 0.3
track width copperThickness1oz (default): min 0.127, default 0.254, max 2.54
track width copperThickness2oz: min 0.203, default 0.254, max 2.54
differential pair differentialPair (default): width min 0.127, default 0.254, max 2.54; gap min 0.152, default 0.152
pour e52 uses Copper_copperRegion
pour e83 uses Copper_copperRegion

## Placement (name value [footprint] x y rotation side)
D1  1N4728ATR  [DO-41_BD2.4-L4.7-P8.70-D0.9-RD]  37.72 6.23 0 top
D2  1N4007G  [DO-41_BD2.4-L4.7-P8.70-D0.9-RD]  60.32 26.42 180 top
D3  1N4728A  [DO-41_BD2.4-L4.7-P8.70-D0.9-RD]  59.82 34.43 180 top
DQ1  WJ500V-5.08-2P  [CONN-TH_2P-P5.00_WJ500V-5.08-2P]  62.74 43.32 270 top
R1  10Ω  [RES-TH_BD9.0-L36.5-P40.50-D0.8]  21.97 28.2 90 top
R2  1kΩ  [RES-TH_BD2.7-L6.2-P10.20-D0.4]  49.66 43.44 270 top
R3  1kΩ  [RES-TH_BD2.7-L6.2-P10.20-D0.4]  37.59 50.94 0 top
R4  1kΩ  [RES-TH_BD2.7-L6.2-P10.20-D0.4]  30.48 35.95 270 top
R5  1kΩ  [RES-TH_BD2.7-L6.2-P10.20-D0.4]  37.72 44.84 0 top
R6  1kΩ  [RES-TH_BD2.7-L6.2-P10.20-D0.4]  37.47 12.71 0 top
R7  1kΩ  [RES-TH_BD2.7-L6.2-P10.20-D0.4]  51.05 30.87 180 top
R8  1kΩ  [RES-TH_BD2.7-L6.2-P10.20-D0.4]  63.5 15.63 90 top
Sampling_current  WJ500V-5.08-2P  [CONN-TH_2P-P5.00_WJ500V-5.08-2P]  7.75 41.66 90 top
U1  LM741N  [DIP-8_L9.3-W6.4-P2.54-LS7.6-BL]  38.86 35.57 180 top
U2  LM2903P  [DIP-8_L9.8-W6.6-P2.54-LS7.6-BL]  38.74 23.63 180 top
U3  LM741N  [DIP-8_L9.3-W6.4-P2.54-LS7.6-BL]  54.23 14.99 0 top
VCC_input1  WJ500V-5.08-2P  [CONN-TH_2P-P5.00_WJ500V-5.08-2P]  7.87 17.53 90 top

## Footprints (pads in the part's own frame, mm; a bottom-side part is the same pattern mirrored in y, then rotated)
CONN-TH_2P-P5.00_WJ500V-5.08-2P
  round 2 hole 1.3: 1(-2.54,0) 2(2.54,0)
DIP-8_L9.3-W6.4-P2.54-LS7.6-BL
  rect 1.8x1.8 hole 1: 1(-3.81,-3.81)
  round 1.8 hole 1: 2(-1.27,-3.81) 3(1.27,-3.81) 4(3.81,-3.81) 5(3.81,3.81) 6(1.27,3.81) 7(-1.27,3.81) 8(-3.81,3.81)
DIP-8_L9.8-W6.6-P2.54-LS7.6-BL
  rect 1.5x1.5 hole 0.9: 1(-3.81,-3.81)
  round 1.5 hole 0.9: 2(-1.27,-3.81) 3(1.27,-3.81) 4(3.81,-3.81) 5(3.81,3.81) 6(1.27,3.81) 7(-1.27,3.81) 8(-3.81,3.81)
DO-41_BD2.4-L4.7-P8.70-D0.9-RD
  round 1.8 hole 1: 1(-4.35,0) 2(4.35,0)
RES-TH_BD2.7-L6.2-P10.20-D0.4
  round 1.4 hole 0.8: 1(-5.1,0) 2(5.1,0)
RES-TH_BD9.0-L36.5-P40.50-D0.8
  round 1.8 hole 1: 1(-21,0) 2(21,0)

## Nets
As in the schematic.

Pads without a net: U1 1 5 8; U2 1 2 3; U3 1 5 8

## Via types
v1: diameter 4.5, hole 3, Top Layer to Bottom Layer, 4 vias

## Routing (per net, layer and track width the routed paths; a pad name or vN(x,y) marks a point on that pad's centre or on a via; arc(x,y) is an arc through that point)
(no net):
  vias: v1(3,51.87) v1(3,2.87) v1(67,51.87) v1(67,2.87)
$1N608: length 29.3
  Top Layer w1.3: R3.1 30.76,49.2 R1.2 9.7,49.2 7.75,47.25 Sampling_current.2
$1N609: length 68.8
  Top Layer w1.3: R4.2 28.7,29.07 28.7,10.17 25.74,7.2 R1.1 20.78,7.2 arc(16.86,8.83) 15.24,12.74 15.24,26.68 7.75,34.17 Sampling_current.1
$1N610: length 20.6
  Top Layer w1.3: R2.1 47.26,50.94 R3.2 42.54,50.79 42.54,47.89 40.97,46.31 40.97,40.22 U1.2
$1N611: length 32.6
  Top Layer w1.3: U2.5 31.75,23 31.75,27.69 33.78,29.73 35.56,29.73 U1.6 37.59,33.66 39.75,35.82 47.14,35.82 R2.2
$1N612: length 12.4
  Top Layer w1.3: 30.5,41.05 34.32,41.05 34.35,41.08 35.76,41.08 ; 30.5,41.05 R4.1 ; 30.5,41.05 32.62,43.17 R5.1 ; U1.3 36.19,40.78 36.19,40.9 36.07,40.9 35.92,41.05
$1N614: length 42.3
  Top Layer w1.1: U2.6 34.94,17.3 32.66,17.3 30.48,15.12 30.48,9.12 D1.1
  Bottom Layer w1.1: U2.6 42.16,24.52 49.78,24.52 56.13,30.87 R7.1
$1N617: length 32.9
  Top Layer w1.3: 40,19.82 40,16.29 39.09,15.38 35.03,15.38 R6.1
  Bottom Layer w1.1: 40,19.82 44.7,15.12 53.59,15.12 55.5,13.22 U3.3
$1N1128: length 98.6
  Top Layer w1.1: VCC_input1.1 7.87,7.25 12.32,2.8 42.8,2.8 45.85,5.85 45.85,9.43 R6.2 ; U1.7 40.13,30.62 41.4,29.35 44.43,29.35 R7.2 45.95,26.79 42.54,23.38 42.54,19.82 46.86,19.82 49.53,22.49 50.63,22.49 52.96,20.16 U3.7
  Top Layer w1.3: 42.54,19.82 42.56,19.8 R6.2
$1N1185: length 8.2
  Top Layer w1.1: 64.68,26.42 66.17,24.93 66.17,22.11 64.79,20.73 R8.2
$1N1187: length 34
  Top Layer w1.1: 63.5,10.53 67.69,14.72 67.69,30.9 D3.1 64.17,39.35 62.74,40.78
$1N1190: length 29.6
  Top Layer w1.1: U3.6 56.01,19.31 56.01,26.39 D2.2
  Bottom Layer w1.1: U3.6 55.5,17.15 59.94,12.71 59.94,7.88 59.17,7.1 57.04,7.1 U3.2

## Copper pours and planes (outline as drawn; the poured copper is in the pictures)
GND on Top Layer: -2.92,56.02 71.88,56.02 71.88,-3.42 -2.92,-3.42
GND on Bottom Layer: -2.03,56.78 72.26,56.78 72.26,-6.47 -2.03,-6.47

Small or netless copper shapes (teardrops, artwork), in the pictures only: 40 on Top Layer, 6 on Bottom Layer

## Text on the board
Top Silkscreen Layer: 过流保护电路

# Board PCB3
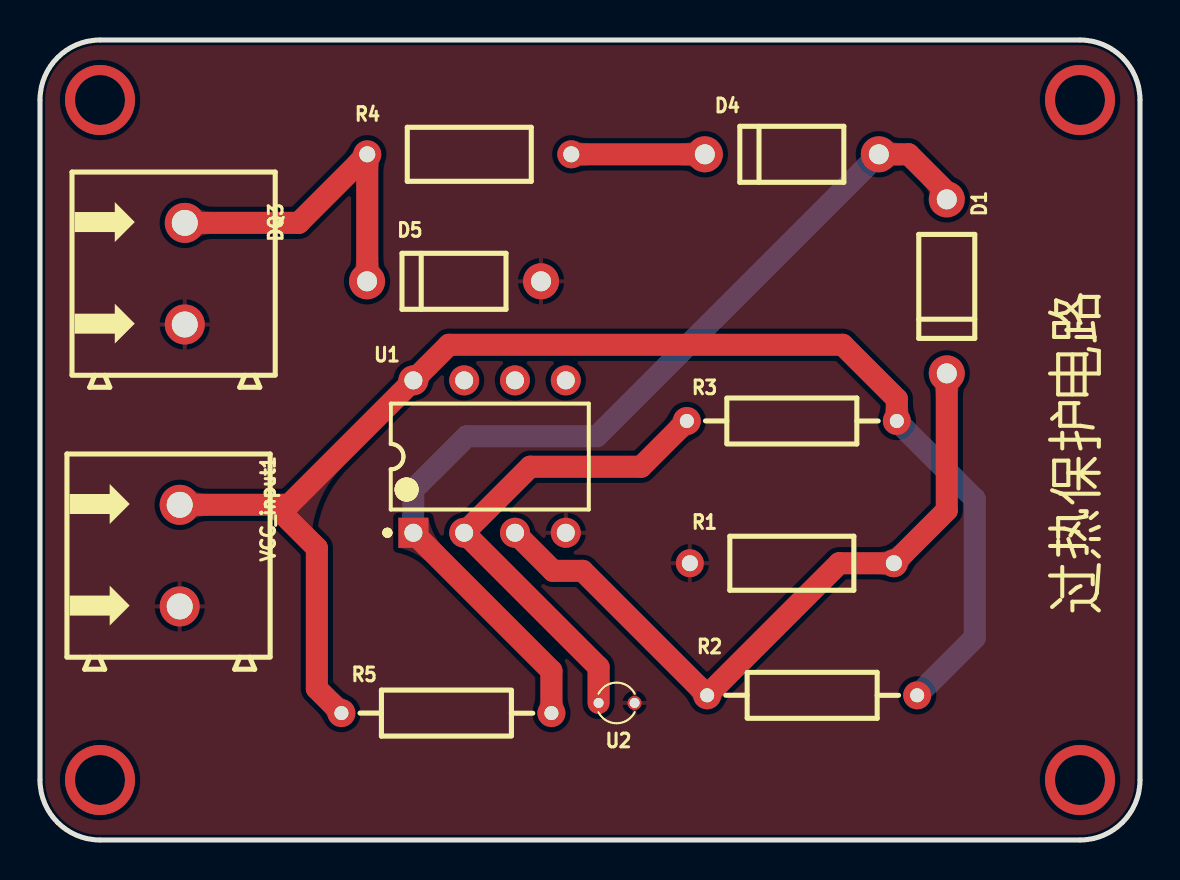
[diagram p5: board, top side]
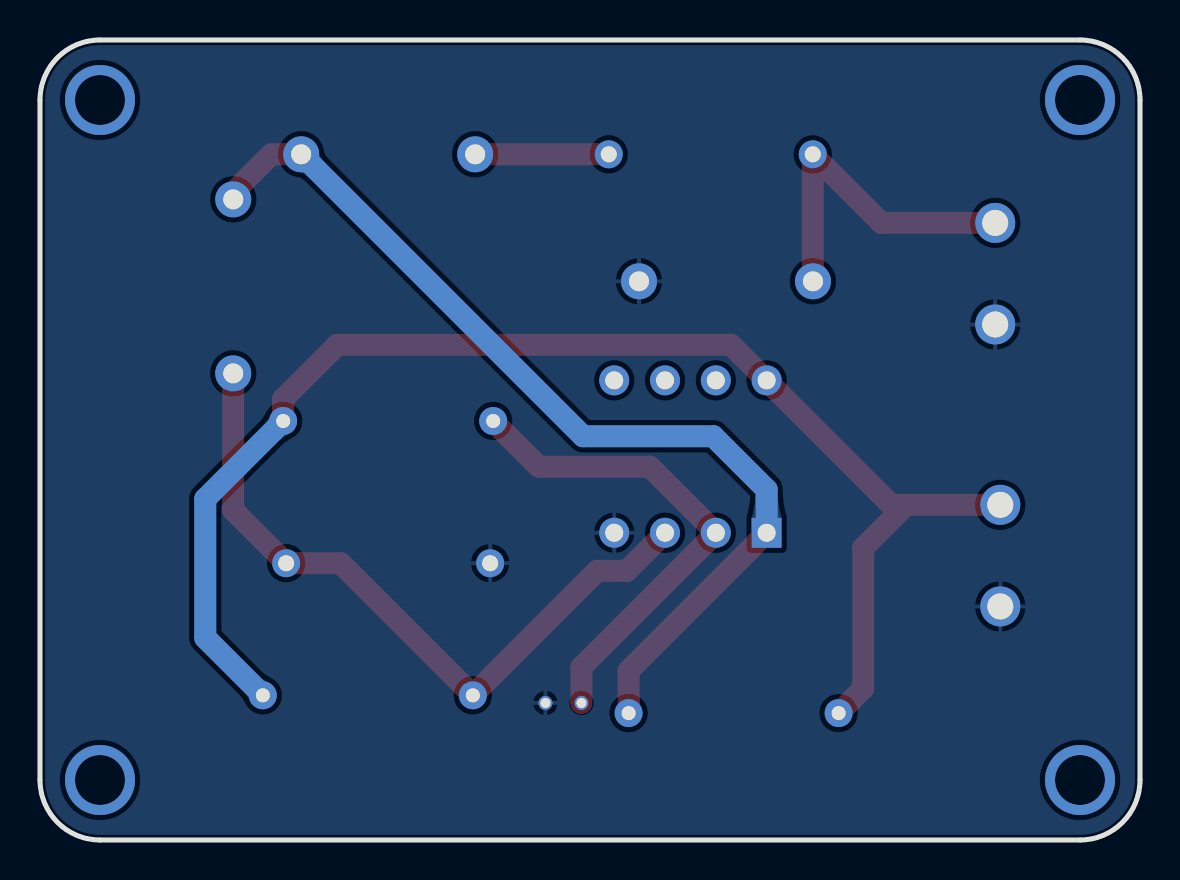
[diagram p6: board, bottom side, seen from below]

Outline 55 x 40 mm; copper layers: Top Layer, Bottom Layer. Coordinates in mm from the lower left corner of the outline.
Outline path: 0,37 0,3 arc(0.88,0.88) 3,0 52,0 arc(54.12,0.88) 55,3 55,37 arc(54.12,39.12) 52,40 3,40 arc(0.88,39.12) 0,37
Stack: Top Layer 0.035mm / Dielectric1 1.51mm FR4 er 4.5 / Bottom Layer 0.035mm

## Design rules (mm)
spacing copperThickness1oz (default): track to track 0.508, other pairs 0.152 to 0.3
spacing copperThickness2oz: track to track 0.203, other pairs 0.152 to 0.3
track width copperThickness1oz (default): min 0.635, default 0.635, max 2.54
track width copperThickness2oz: min 0.203, default 0.254, max 2.54
differential pair differentialPair (default): width min 0.127, default 0.254, max 2.54; gap min 0.152, default 0.152
net GND uses copperRegion

## Placement (name value [footprint] x y rotation side)
D1  1N4007G  [DO-41_BD2.4-L4.7-P8.70-D0.9-RD]  45.34 27.68 90 top
D4  1N4007G  [DO-41_BD2.4-L4.7-P8.70-D0.9-RD]  37.59 34.28 0 top
D5  1N4728A  [DO-41_BD2.4-L4.7-P8.70-D0.9-RD]  20.7 27.94 0 top
DQ3  WJ500V-5.08-2P  [CONN-TH_2P-P5.00_WJ500V-5.08-2P]  7.24 28.32 90 top
R1  1kΩ  [RES-TH_BD2.7-L6.2-P10.20-D0.4]  37.59 13.84 0 top
R2  2kΩ  [RES-TH_BD2.3-L6.5-P10.50-D0.5]  38.61 7.23 180 top
R3  75kΩ  [RES-TH_BD2.3-L6.5-P10.50-D0.5]  37.59 20.95 180 top
R4  1kΩ  [RES-TH_BD2.7-L6.2-P10.20-D0.4]  21.46 34.28 0 top
R5  2kΩ  [RES-TH_BD2.3-L6.5-P10.50-D0.5]  20.32 6.34 0 top
U1  LM2903P  [DIP-8_L9.8-W6.6-P2.54-LS7.6-BL]  22.48 19.17 0 top
U2  MT52B103F3950F01000  [RES-TH_BD2.0-P1.80-D0.3]  28.83 6.85 180 top
VCC_input1  WJ500V-5.08-2P  [CONN-TH_2P-P5.00_WJ500V-5.08-2P]  6.98 14.22 90 top

## Footprints (pads in the part's own frame, mm; a bottom-side part is the same pattern mirrored in y, then rotated)
CONN-TH_2P-P5.00_WJ500V-5.08-2P
  round 2 hole 1.3: 1(-2.54,0) 2(2.54,0)
DIP-8_L9.8-W6.6-P2.54-LS7.6-BL
  rect 1.5x1.5 hole 0.9: 1(-3.81,-3.81)
  round 1.5 hole 0.9: 2(-1.27,-3.81) 3(1.27,-3.81) 4(3.81,-3.81) 5(3.81,3.81) 6(1.27,3.81) 7(-1.27,3.81) 8(-3.81,3.81)
DO-41_BD2.4-L4.7-P8.70-D0.9-RD
  round 1.8 hole 1: 1(-4.35,0) 2(4.35,0)
RES-TH_BD2.0-P1.80-D0.3
  round 0.7 hole 0.5: 1(-0.9,0) 2(0.9,0)
RES-TH_BD2.3-L6.5-P10.50-D0.5
  round 1.4 hole 0.7: 1(-5.25,0) 2(5.25,0)
RES-TH_BD2.7-L6.2-P10.20-D0.4
  round 1.4 hole 0.8: 1(-5.1,0) 2(5.1,0)

## Nets
GND: D5.2 DQ3.1 R1.1 U1.4 U2.1 VCC_input1.1
DQ3: D5.1 DQ3.2 R4.1
$1N1: D1.1 R1.2 R2.2 U1.3
$1N2: R3.2 U1.2 U2.2
$1N3: D1.2 D4.2 R5.2 U1.1
$1N5: R2.1 R3.1 R5.1 U1.8 VCC_input1.2
$1N12: D4.1 R4.2

Pads without a net: U1 5 6 7

## Via types
v1: diameter 3.5, hole 2.5, Top Layer to Bottom Layer, 4 vias

## Routing (per net, layer and track width the routed paths; a pad name or vN(x,y) marks a point on that pad's centre or on a via; arc(x,y) is an arc through that point)
(no net):
  vias: v1(3,37) v1(3,3) v1(52,37) v1(52,3)
DQ3: length 16.9
  Top Layer w1.1: DQ3.2 12.93,30.86 R4.1 16.36,27.95 D5.1
$1N1: length 35.6
  Top Layer w1.1: 23.75,15.36 25.65,13.46 27.13,13.46 R2.2 39.96,13.84 R1.2 45.34,16.48 D1.1
$1N2: length 24.7
  Top Layer w1.1: R3.2 30.06,18.66 24.51,18.66 U1.2 27.93,8.64 U2.2
$1N3: length 48.8
  Top Layer w1.1: U1.1 25.57,8.46 R5.2 ; D4.2 43.43,34.28 45.34,32.38 45.34,32.03
  Bottom Layer w1.1: D4.2 27.84,20.19 21.34,20.19 18.67,17.52 U1.1
$1N5: length 69.7
  Top Layer w1.1: VCC_input1.2 11.68,16.76 ; 11.68,16.76 13.84,14.6 13.84,7.57 R5.1 ; 11.68,16.76 12.45,16.76 U1.8 20.45,24.76 40.13,24.76 42.84,22.05 R3.1
  Bottom Layer w1.1: R3.1 46.74,17.06 46.74,10.11 R2.1
$1N12: length 6.7
  Top Layer w1.1: R4.2 D4.1

## Copper pours and planes (outline as drawn; the poured copper is in the pictures)
GND on Top Layer: -3.68,42.16 56.77,42.16 56.77,-4.2 -3.68,-4.2
GND on Bottom Layer: -1.27,41.91 55.75,41.91 55.75,-2.93 -1.27,-2.93

Small or netless copper shapes (teardrops, artwork), in the pictures only: 25 on Top Layer, 4 on Bottom Layer

## Text on the board
Top Silkscreen Layer: 过热保护电路

# Board PCB2
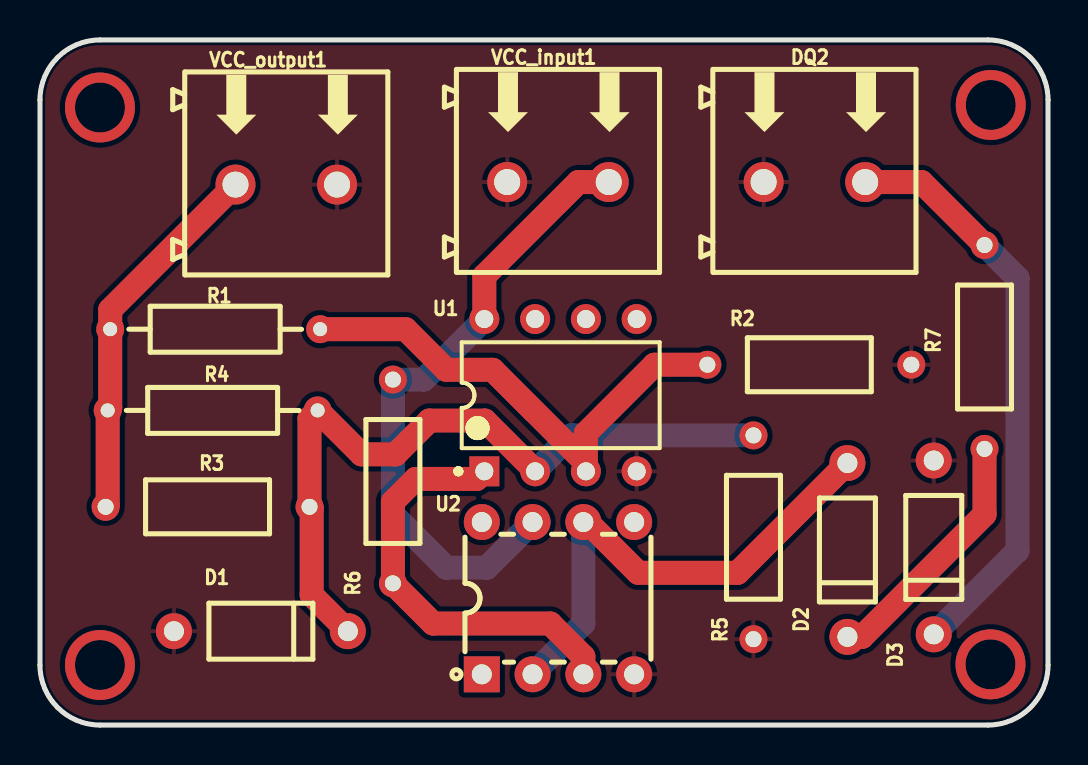
[diagram p7: board, top side]
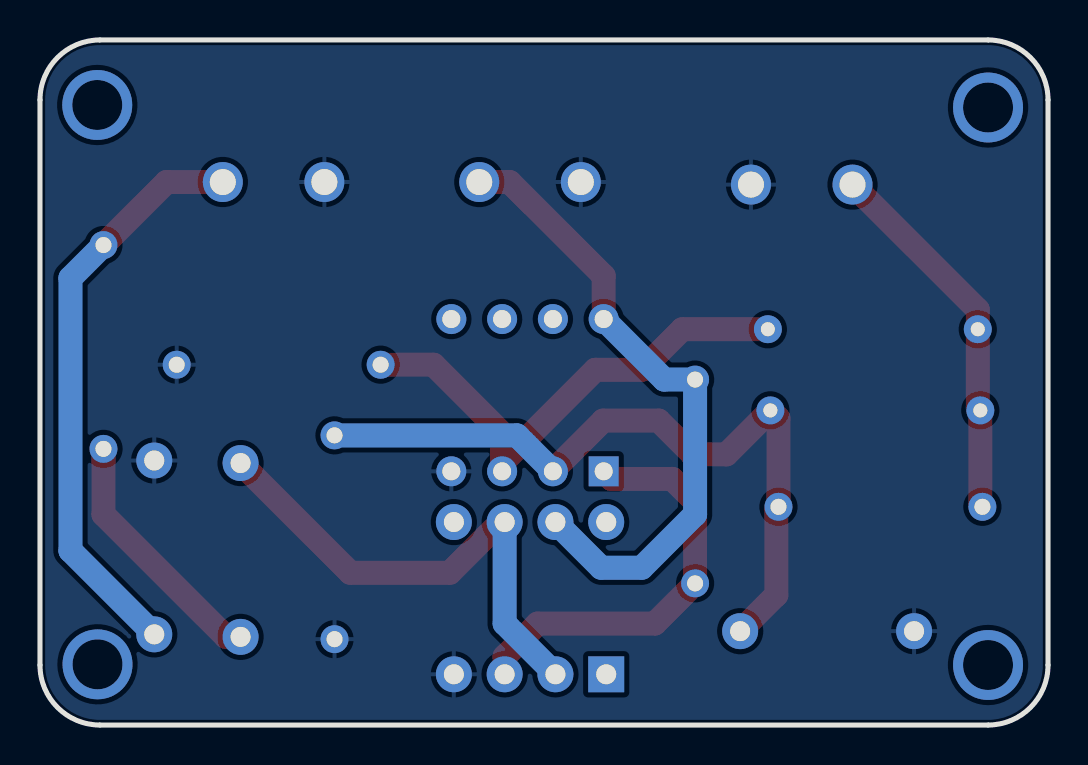
[diagram p8: board, bottom side, seen from below]

Outline 50.42 x 34.29 mm; copper layers: Top Layer, Bottom Layer. Coordinates in mm from the lower left corner of the outline.
Outline path: 0,31.29 0,3 arc(0.88,0.88) 3,0 47.42,0 arc(49.54,0.88) 50.42,3 50.42,31.29 arc(49.54,33.41) 47.42,34.29 3,34.29 arc(0.88,33.41) 0,31.29
Stack: Top Layer 0.035mm / Dielectric1 1.51mm FR4 er 4.5 / Bottom Layer 0.035mm

## Design rules (mm)
spacing copperThickness1oz (default): track to track 0.102, other pairs 0.152 to 0.3
spacing copperThickness2oz: track to track 0.203, other pairs 0.152 to 0.3
spacing Plane_innerPlane: track to track 0.102, other pairs 0.152 to 0.3
spacing Copper_copperRegion: track to track 0.102, other pairs 0.152 to 0.3
track width copperThickness1oz (default): min 0.127, default 0.254, max 2.54
track width copperThickness2oz: min 0.203, default 0.254, max 2.54
differential pair differentialPair (default): width min 0.127, default 0.254, max 2.54; gap min 0.152, default 0.152
pour e6 uses Copper_copperRegion
pour e44 uses Copper_copperRegion

## Placement (name value [footprint] x y rotation side)
D1  1N4728ATR  [DO-41_BD2.4-L4.7-P8.70-D0.9-RD]  11.05 4.7 180 top
D2  1N4007G  [DO-41_BD2.4-L4.7-P8.70-D0.9-RD]  40.39 8.76 90 top
D3  1N4728A  [DO-41_BD2.4-L4.7-P8.70-D0.9-RD]  44.7 8.89 90 top
DQ2  WJ500V-5.08-2P  [CONN-TH_2P-P5.00_WJ500V-5.08-2P]  38.74 27.18 0 top
R1  15kΩ  [RES-TH_BD2.3-L6.5-P10.50-D0.5]  8.76 19.81 0 top
R2  2kΩ  [RES-TH_BD2.7-L6.2-P10.20-D0.4]  38.48 18.03 180 top
R3  1kΩ  [RES-TH_BD2.7-L6.2-P10.20-D0.4]  8.38 10.92 180 top
R4  2kΩ  [RES-TH_BD2.3-L6.5-P10.50-D0.5]  8.64 15.75 0 top
R5  1kΩ  [RES-TH_BD2.7-L6.2-P10.20-D0.4]  35.69 9.4 90 top
R6  1kΩ  [RES-TH_BD2.7-L6.2-P10.20-D0.4]  17.65 12.19 90 top
R7  3.3kΩ  [RES-TH_BD2.7-L6.2-P10.20-D0.4]  47.24 18.92 270 top
U1  LM2903P  [DIP-8_L9.8-W6.6-P2.54-LS7.6-BL]  26.03 16.51 0 top
U2  LM741N  [DIP-8_L9.3-W6.4-P2.54-LS7.6-BL]  25.91 6.35 0 top
VCC_input1  WJ500V-5.08-2P  [CONN-TH_2P-P5.00_WJ500V-5.08-2P]  25.91 27.18 0 top
VCC_output1  WJ500V-5.08-2P  [CONN-TH_2P-P5.00_WJ500V-5.08-2P]  12.32 27.05 0 top

## Footprints (pads in the part's own frame, mm; a bottom-side part is the same pattern mirrored in y, then rotated)
CONN-TH_2P-P5.00_WJ500V-5.08-2P
  round 2 hole 1.3: 1(-2.54,0) 2(2.54,0)
DIP-8_L9.3-W6.4-P2.54-LS7.6-BL
  rect 1.8x1.8 hole 1: 1(-3.81,-3.81)
  round 1.8 hole 1: 2(-1.27,-3.81) 3(1.27,-3.81) 4(3.81,-3.81) 5(3.81,3.81) 6(1.27,3.81) 7(-1.27,3.81) 8(-3.81,3.81)
DIP-8_L9.8-W6.6-P2.54-LS7.6-BL
  rect 1.5x1.5 hole 0.9: 1(-3.81,-3.81)
  round 1.5 hole 0.9: 2(-1.27,-3.81) 3(1.27,-3.81) 4(3.81,-3.81) 5(3.81,3.81) 6(1.27,3.81) 7(-1.27,3.81) 8(-3.81,3.81)
DO-41_BD2.4-L4.7-P8.70-D0.9-RD
  round 1.8 hole 1: 1(-4.35,0) 2(4.35,0)
RES-TH_BD2.3-L6.5-P10.50-D0.5
  round 1.4 hole 0.7: 1(-5.25,0) 2(5.25,0)
RES-TH_BD2.7-L6.2-P10.20-D0.4
  round 1.4 hole 0.8: 1(-5.1,0) 2(5.1,0)

## Nets
As in the schematic.

Pads without a net: U1 5 6 7; U2 1 5 8

## Via types
v1: diameter 3.5, hole 2.5, Top Layer to Bottom Layer, 4 vias

## Routing (per net, layer and track width the routed paths; a pad name or vN(x,y) marks a point on that pad's centre or on a via; arc(x,y) is an arc through that point)
(no net):
  vias: v1(3,30.91) v1(3,3.01) v1(47.54,3.04) v1(47.56,31.04)
$1N377: length 37.2
  Top Layer w1.2: D1.1 13.59,6.51 13.59,10.82 R3.1 13.48,15.34 R4.2 16.09,13.55 17.78,13.55 19.47,15.24 22.25,15.24 24.76,12.72 U1.2
  Bottom Layer w1.2: U1.2 26.56,14.5 R5.2
$1N380: length 25.5
  Top Layer w1.2: R1.2 18.29,19.81 20.32,17.78 22.64,17.78 27.31,13.12 ; 27.31,13.12 27.31,14.61 30.73,18.03 R2.2 ; 27.31,13.12 U1.3
$1N382: length 18.8
  Top Layer w1.2: VCC_output1.1 3.51,20.79 R1.1 3.51,15.88 R4.1 3.39,11.03 R3.2
$1N684: length 31.9
  Top Layer w1.2: VCC_input1.2 26.92,27.18 22.22,22.48 U1.8
  Bottom Layer w1.2: U2.7 22.35,7.87 20.32,7.87 17.65,10.54 R6.2 19.2,17.29 U1.8
$1N799: length 21.2
  Top Layer w1.2: U2.3 27.18,3.43 25.53,5.08 19.66,5.08 R6.1 17.65,11.18 18.8,12.32 21.84,12.32 U1.1
$1N820: length 29.2
  Top Layer w1.2: R7.1 44.09,27.18 DQ2.2
  Bottom Layer w1.2: R7.1 48.9,22.37 48.9,8.73 D3.1
$1N822: length 12.7
  Top Layer w1.2: D2.1 41.12,4.41 47.24,10.54 R7.2
$1N824: length 25.2
  Top Layer w1.2: D2.2 34.89,7.62 29.92,7.62 27.38,10.16 U2.6
  Bottom Layer w1.2: U2.2 27.18,5.08 U2.6

## Copper pours and planes (outline as drawn; the poured copper is in the pictures)
GND on Top Layer: -1.14,37.47 57.02,37.47 57.02,-4.83 -1.14,-4.83
GND on Bottom Layer: -3.56,36.32 55.12,36.32 55.12,-5.08 -3.56,-5.08
